# EAGLE design CombinedBackplane02_shorter_2layer (EAGLE 7.7.0)

## Sheet 1 of 4
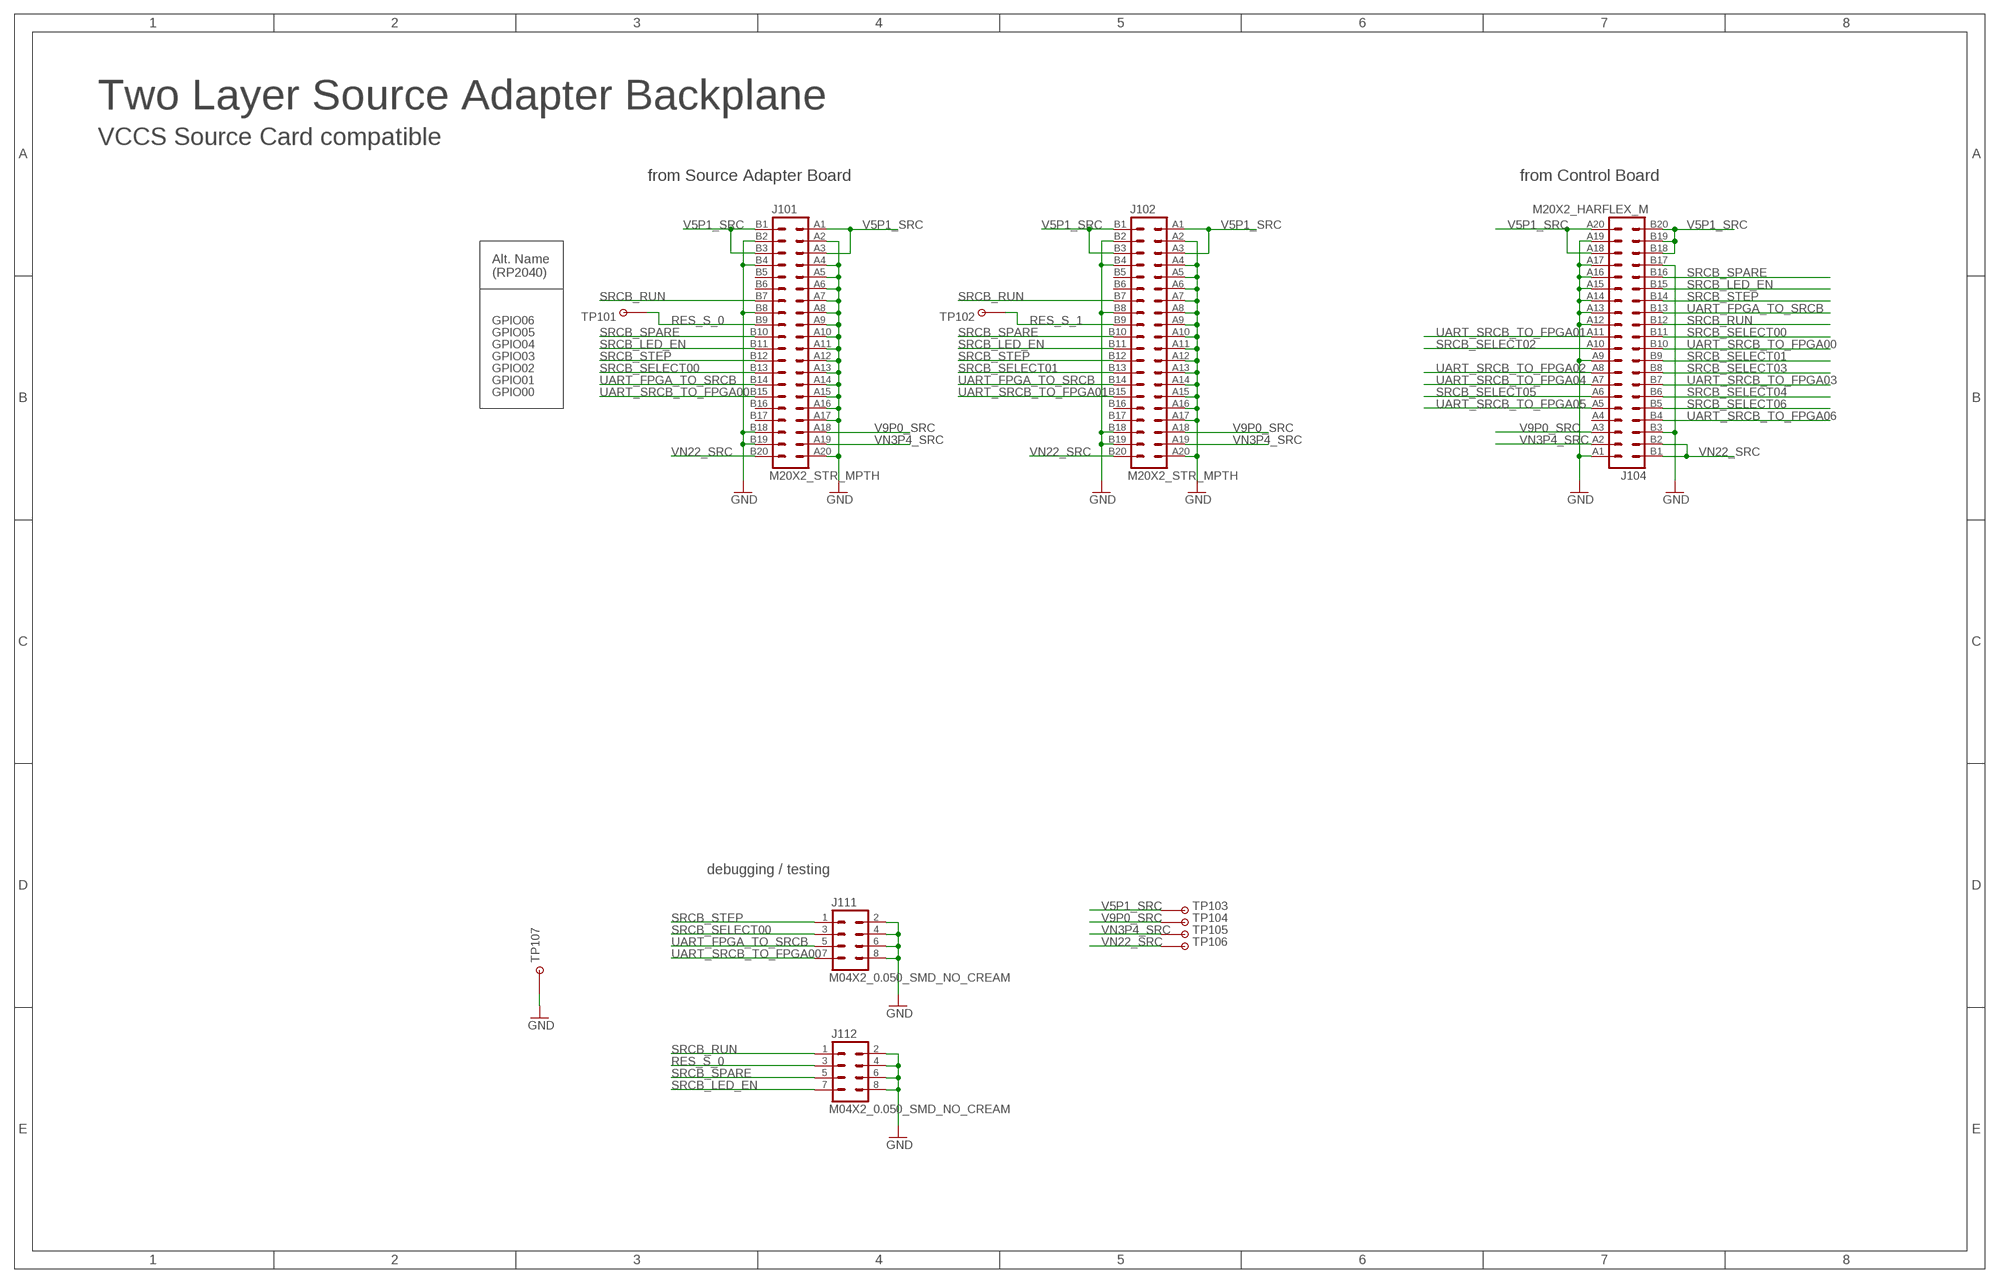
[diagram p0: schematic, sheet 1]

### Parts
J101  M20X2_STR_MPTH  [M20X2_HARFLEX_F_STR_MPTH]
J102  M20X2_STR_MPTH  [M20X2_HARFLEX_F_STR_MPTH]
J104  M20X2_HARFLEX_M  [M20X2_HARFLEX_M]
J111  M04X2_0.050_SMD_NO_CREAM  [M04X2_0.050_SMD_NO_CREAM]
J112  M04X2_0.050_SMD_NO_CREAM  [M04X2_0.050_SMD_NO_CREAM]
TP101  TESTPOINT_ROUND  [TESTPAD_ROUND]
TP102  TESTPOINT_ROUND  [TESTPAD_ROUND]
TP103  TESTPOINT_ROUND  [TESTPAD_ROUND]
TP104  TESTPOINT_ROUND  [TESTPAD_ROUND]
TP105  TESTPOINT_ROUND  [TESTPAD_ROUND]
TP106  TESTPOINT_ROUND  [TESTPAD_ROUND]
TP107  TESTPOINT1X01  [1X01]

### Nets
GND_SRC: J101.A2 J101.A4 J101.A5 J101.A6 J101.A7 J101.A8 J101.A9 J101.A10 J101.A11 J101.A12 J101.A13 J101.A14 J101.A15 J101.A16 J101.A17 J101.A20 J101.B2 J101.B4 J101.B8 J101.B18 J101.B19 J102.A2 J102.A4 J102.A5 J102.A6 J102.A7 J102.A8 J102.A9 J102.A10 J102.A11 J102.A12 J102.A13 J102.A14 J102.A15 J102.A16 J102.A17 J102.A20 J102.B2 J102.B4 J102.B8 J102.B18 J102.B19 J104.A1 J104.A9 J104.A12 J104.A13 J104.A14 J104.A15 J104.A16 J104.A17 J104.A19 J104.B3 J104.B17 J111.2 J111.4 J111.6 J111.8 J112.2 J112.4 J112.6 J112.8 TP107.1 ; supply symbol labelled GND
RES_S_0: J101.B9 J112.3 TP101.P$1
RES_S_1: J102.B9 TP102.P$1
SRCB_LED_EN: J101.B11 J102.B11 J104.B15 J112.7
SRCB_RUN: J101.B7 J102.B7 J104.B12 J112.1
SRCB_SELECT00: J101.B13 J104.B11 J111.3
SRCB_SELECT01: J102.B13 J104.B9
SRCB_SELECT02: J104.A10
SRCB_SELECT03: J104.B8
SRCB_SELECT04: J104.B6
SRCB_SELECT05: J104.A6
SRCB_SELECT06: J104.B5
SRCB_SPARE: J101.B10 J102.B10 J104.B16 J112.5
SRCB_STEP: J101.B12 J102.B12 J104.B14 J111.1
UART_FPGA_TO_SRCB: J101.B14 J102.B14 J104.B13 J111.5
UART_SRCB_TO_FPGA00: J101.B15 J104.B10 J111.7
UART_SRCB_TO_FPGA01: J102.B15 J104.A11
UART_SRCB_TO_FPGA02: J104.A8
UART_SRCB_TO_FPGA03: J104.B7
UART_SRCB_TO_FPGA04: J104.A7
UART_SRCB_TO_FPGA05: J104.A5
UART_SRCB_TO_FPGA06: J104.B4
V5P1_SRC: J101.A1 J101.A3 J101.B1 J101.B3 J102.A1 J102.A3 J102.B1 J102.B3 J104.A18 J104.A20 J104.B18 J104.B19 J104.B20 TP103.P$1
V9P0_SRC: J101.A18 J102.A18 J104.A3 TP104.P$1
VN3P4_SRC: J101.A19 J102.A19 J104.A2 TP105.P$1
VN22_SRC: J101.B20 J102.B20 J104.B1 J104.B2 TP106.P$1
Unconnected: J101.B5 J101.B6 J101.B16 J101.B17 J102.B5 J102.B6 J102.B16 J102.B17 J104.A4

### Notes on the sheet
- Two Layer Source Adapter Backplane
- VCCS Source Card compatible
- from Source Adapter Board | from Control Board
- Alt. Name
  (RP2040)
- GPIO06
- GPIO05
- GPIO04
- GPIO03
- GPIO02
- GPIO01
- GPIO00
- debugging / testing

## Sheet 2 of 4
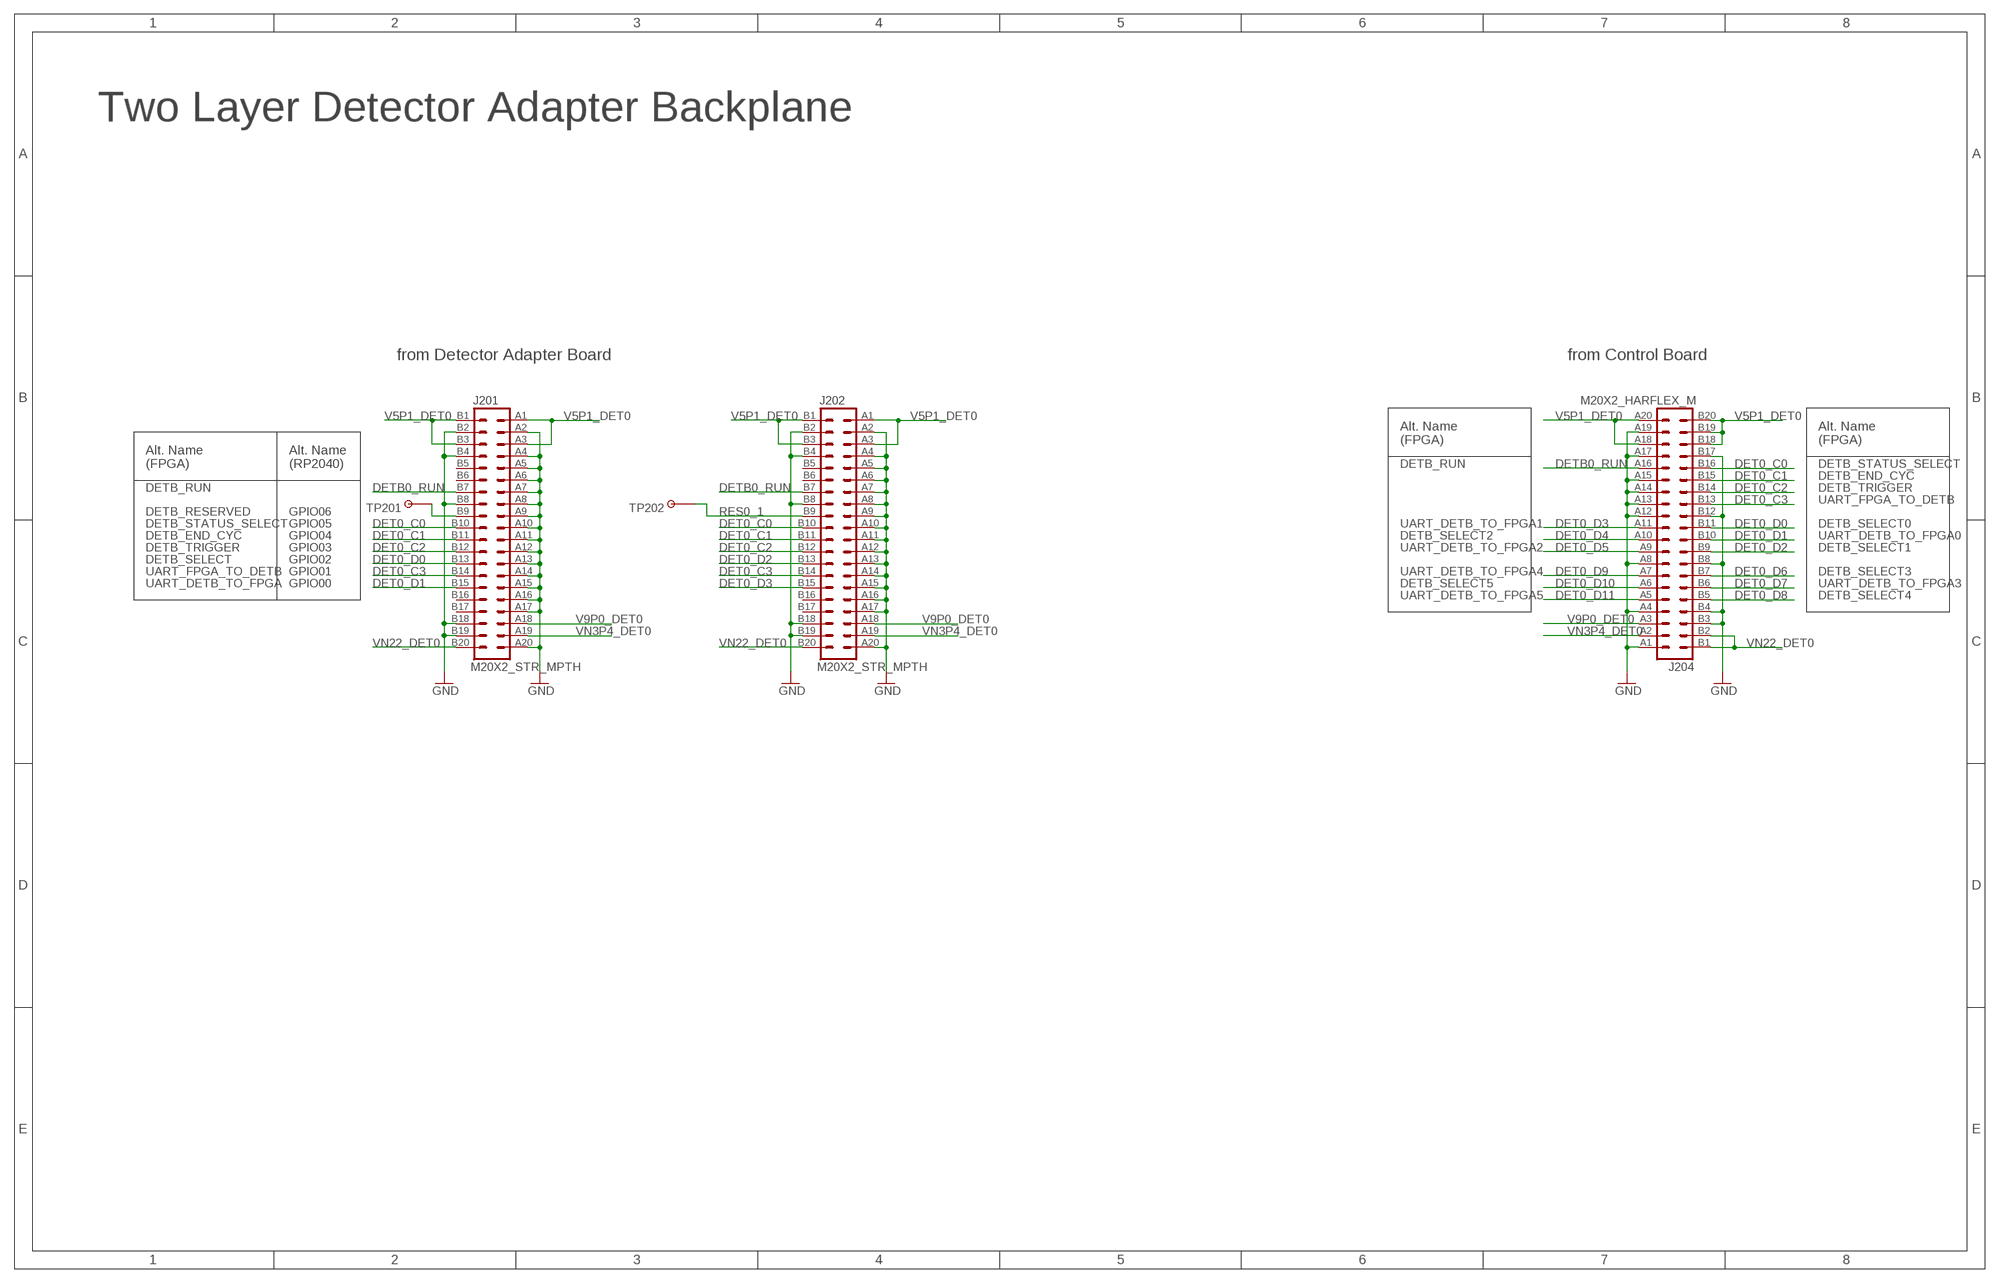
[diagram p1: schematic, sheet 2]

### Parts
J201  M20X2_STR_MPTH  [M20X2_HARFLEX_F_STR_MPTH]
J202  M20X2_STR_MPTH  [M20X2_HARFLEX_F_STR_MPTH]
J204  M20X2_HARFLEX_M  [M20X2_HARFLEX_M]
TP201  TESTPOINT_ROUND  [TESTPAD_ROUND]
TP202  TESTPOINT_ROUND  [TESTPAD_ROUND]

### Nets
DET0_C0: J201.B10 J202.B10 J204.B16
DET0_C1: J201.B11 J202.B11 J204.B15
DET0_C2: J201.B12 J202.B12 J204.B14
DET0_C3: J201.B14 J202.B14 J204.B13
DET0_D0: J201.B13 J204.B11
DET0_D1: J201.B15 J204.B10
DET0_D2: J202.B13 J204.B9
DET0_D3: J202.B15 J204.A11
DET0_D4: J204.A10
DET0_D5: J204.A9
DET0_D6: J204.B7
DET0_D7: J204.B6
DET0_D8: J204.B5
DET0_D9: J204.A7
DET0_D10: J204.A6
DET0_D11: J204.A5
DETB0_RUN: J201.B7 J202.B7 J204.A16
GND: J201.A2 J201.A4 J201.A5 J201.A6 J201.A7 J201.A8 J201.A9 J201.A10 J201.A11 J201.A12 J201.A13 J201.A14 J201.A15 J201.A16 J201.A17 J201.A20 J201.B2 J201.B4 J201.B8 J201.B18 J201.B19 J202.A2 J202.A4 J202.A5 J202.A6 J202.A7 J202.A8 J202.A9 J202.A10 J202.A11 J202.A12 J202.A13 J202.A14 J202.A15 J202.A16 J202.A17 J202.A20 J202.B2 J202.B4 J202.B8 J202.B18 J202.B19 J204.A1 J204.A4 J204.A8 J204.A12 J204.A13 J204.A14 J204.A15 J204.A17 J204.A19 J204.B3 J204.B4 J204.B8 J204.B12 J204.B17 ; also sheet 3,4
N$2: J201.B9 TP201.P$1
RES0_1: J202.B9 TP202.P$1
V5P1_DET0: J201.A1 J201.A3 J201.B1 J201.B3 J202.A1 J202.A3 J202.B1 J202.B3 J204.A18 J204.A20 J204.B18 J204.B19 J204.B20
V9P0_DET0: J201.A18 J202.A18 J204.A3
VN3P4_DET0: J201.A19 J202.A19 J204.A2
VN22_DET0: J201.B20 J202.B20 J204.B1 J204.B2
Unconnected: J201.B5 J201.B6 J201.B16 J201.B17 J202.B5 J202.B6 J202.B16 J202.B17

### Notes on the sheet
- Two Layer Detector Adapter Backplane
- from Detector Adapter Board | from Control Board
- Alt. Name
  (FPGA)
- Alt. Name
  (FPGA)
- Alt. Name
  (FPGA)
- Alt. Name
  (RP2040)
- DETB_RUN | DETB_STATUS_SELECT
- DETB_END_CYC
- DETB_RUN | DETB_TRIGGER
- UART_FPGA_TO_DETB
- DETB_RESERVED | GPIO06
- DETB_STATUS_SELECT | GPIO05 | UART_DETB_TO_FPGA1 | DETB_SELECT0
- DETB_END_CYC | GPIO04 | DETB_SELECT2 | UART_DETB_TO_FPGA0
- DETB_TRIGGER | GPIO03 | UART_DETB_TO_FPGA2 | DETB_SELECT1
- DETB_SELECT | GPIO02
- UART_FPGA_TO_DETB | GPIO01 | UART_DETB_TO_FPGA4 | DETB_SELECT3
- UART_DETB_TO_FPGA | GPIO00 | DETB_SELECT5 | UART_DETB_TO_FPGA3
- UART_DETB_TO_FPGA5 | DETB_SELECT4

## Sheet 3 of 4
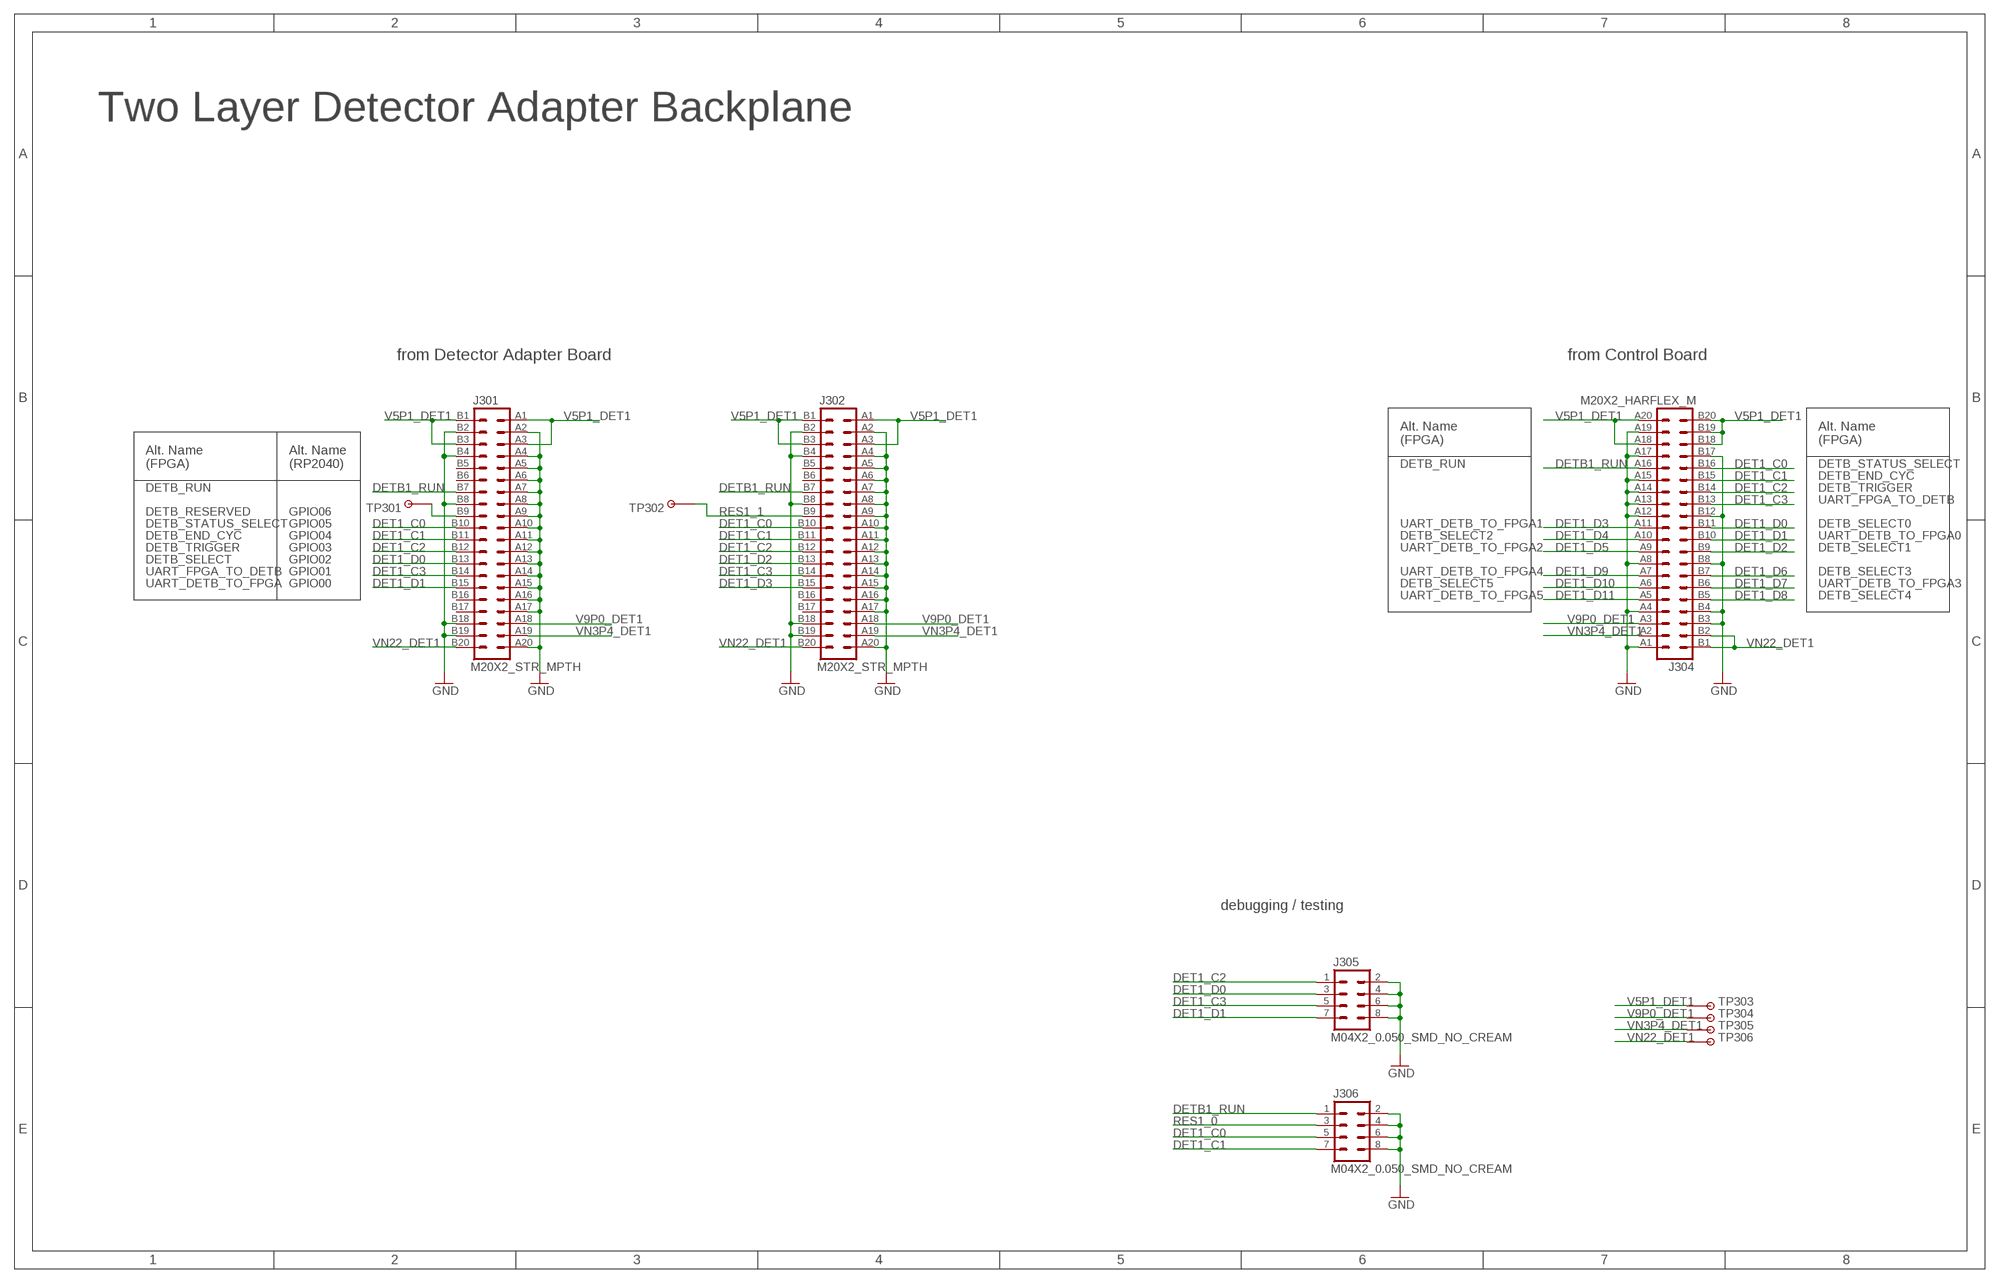
[diagram p2: schematic, sheet 3]

### Parts
J301  M20X2_STR_MPTH  [M20X2_HARFLEX_F_STR_MPTH]
J302  M20X2_STR_MPTH  [M20X2_HARFLEX_F_STR_MPTH]
J304  M20X2_HARFLEX_M  [M20X2_HARFLEX_M]
J305  M04X2_0.050_SMD_NO_CREAM  [M04X2_0.050_SMD_NO_CREAM]
J306  M04X2_0.050_SMD_NO_CREAM  [M04X2_0.050_SMD_NO_CREAM]
TP301  TESTPOINT_ROUND  [TESTPAD_ROUND]
TP302  TESTPOINT_ROUND  [TESTPAD_ROUND]
TP303  TESTPOINT_ROUND  [TESTPAD_ROUND]
TP304  TESTPOINT_ROUND  [TESTPAD_ROUND]
TP305  TESTPOINT_ROUND  [TESTPAD_ROUND]
TP306  TESTPOINT_ROUND  [TESTPAD_ROUND]

### Nets
DET1_C0: J301.B10 J302.B10 J304.B16 J306.5
DET1_C1: J301.B11 J302.B11 J304.B15 J306.7
DET1_C2: J301.B12 J302.B12 J304.B14 J305.1
DET1_C3: J301.B14 J302.B14 J304.B13 J305.5
DET1_D0: J301.B13 J304.B11 J305.3
DET1_D1: J301.B15 J304.B10 J305.7
DET1_D2: J302.B13 J304.B9
DET1_D3: J302.B15 J304.A11
DET1_D4: J304.A10
DET1_D5: J304.A9
DET1_D6: J304.B7
DET1_D7: J304.B6
DET1_D8: J304.B5
DET1_D9: J304.A7
DET1_D10: J304.A6
DET1_D11: J304.A5
DETB1_RUN: J301.B7 J302.B7 J304.A16 J306.1
GND: J301.A2 J301.A4 J301.A5 J301.A6 J301.A7 J301.A8 J301.A9 J301.A10 J301.A11 J301.A12 J301.A13 J301.A14 J301.A15 J301.A16 J301.A17 J301.A20 J301.B2 J301.B4 J301.B8 J301.B18 J301.B19 J302.A2 J302.A4 J302.A5 J302.A6 J302.A7 J302.A8 J302.A9 J302.A10 J302.A11 J302.A12 J302.A13 J302.A14 J302.A15 J302.A16 J302.A17 J302.A20 J302.B2 J302.B4 J302.B8 J302.B18 J302.B19 J304.A1 J304.A4 J304.A8 J304.A12 J304.A13 J304.A14 J304.A15 J304.A17 J304.A19 J304.B3 J304.B4 J304.B8 J304.B12 J304.B17 J305.2 J305.4 J305.6 J305.8 J306.2 J306.4 J306.6 J306.8 ; also sheet 2,4
RES1_0: J301.B9 J306.3 TP301.P$1
RES1_1: J302.B9 TP302.P$1
V5P1_DET1: J301.A1 J301.A3 J301.B1 J301.B3 J302.A1 J302.A3 J302.B1 J302.B3 J304.A18 J304.A20 J304.B18 J304.B19 J304.B20 TP303.P$1
V9P0_DET1: J301.A18 J302.A18 J304.A3 TP304.P$1
VN3P4_DET1: J301.A19 J302.A19 J304.A2 TP305.P$1
VN22_DET1: J301.B20 J302.B20 J304.B1 J304.B2 TP306.P$1
Unconnected: J301.B5 J301.B6 J301.B16 J301.B17 J302.B5 J302.B6 J302.B16 J302.B17

### Notes on the sheet
- Two Layer Detector Adapter Backplane
- from Detector Adapter Board | from Control Board
- Alt. Name
  (FPGA)
- Alt. Name
  (FPGA)
- Alt. Name
  (FPGA)
- Alt. Name
  (RP2040)
- DETB_RUN | DETB_STATUS_SELECT
- DETB_END_CYC
- DETB_RUN | DETB_TRIGGER
- UART_FPGA_TO_DETB
- DETB_RESERVED | GPIO06
- DETB_STATUS_SELECT | GPIO05 | UART_DETB_TO_FPGA1 | DETB_SELECT0
- DETB_END_CYC | GPIO04 | DETB_SELECT2 | UART_DETB_TO_FPGA0
- DETB_TRIGGER | GPIO03 | UART_DETB_TO_FPGA2 | DETB_SELECT1
- DETB_SELECT | GPIO02
- UART_FPGA_TO_DETB | GPIO01 | UART_DETB_TO_FPGA4 | DETB_SELECT3
- UART_DETB_TO_FPGA | GPIO00 | DETB_SELECT5 | UART_DETB_TO_FPGA3
- UART_DETB_TO_FPGA5 | DETB_SELECT4
- debugging / testing

## Sheet 4 of 4
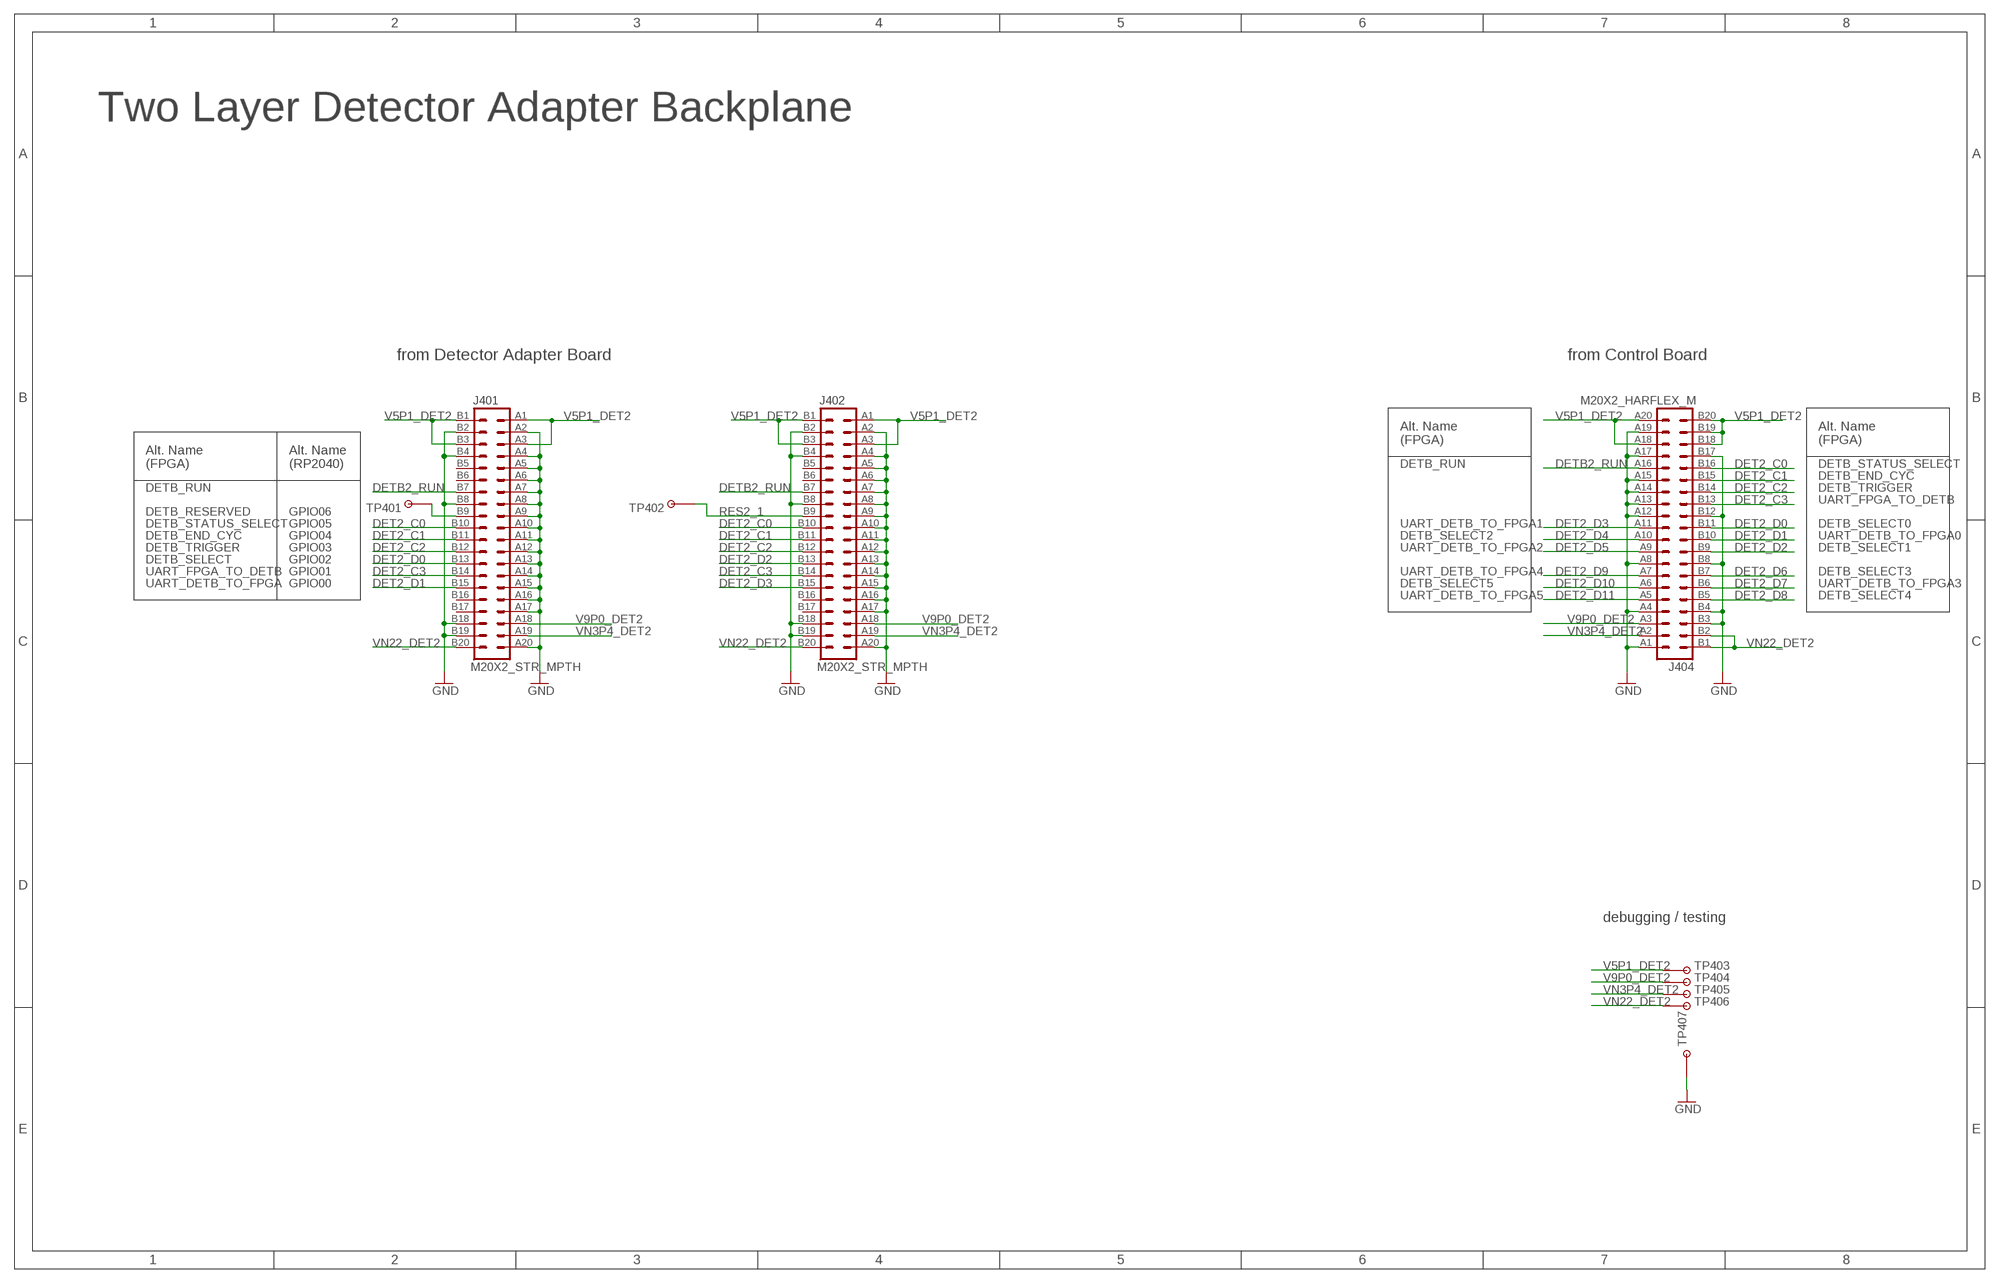
[diagram p3: schematic, sheet 4]

### Parts
J401  M20X2_STR_MPTH  [M20X2_HARFLEX_F_STR_MPTH]
J402  M20X2_STR_MPTH  [M20X2_HARFLEX_F_STR_MPTH]
J404  M20X2_HARFLEX_M  [M20X2_HARFLEX_M]
TP401  TESTPOINT_ROUND  [TESTPAD_ROUND]
TP402  TESTPOINT_ROUND  [TESTPAD_ROUND]
TP403  TESTPOINT_ROUND  [TESTPAD_ROUND]
TP404  TESTPOINT_ROUND  [TESTPAD_ROUND]
TP405  TESTPOINT_ROUND  [TESTPAD_ROUND]
TP406  TESTPOINT_ROUND  [TESTPAD_ROUND]
TP407  TESTPOINT1X01  [1X01]

### Nets
DET2_C0: J401.B10 J402.B10 J404.B16
DET2_C1: J401.B11 J402.B11 J404.B15
DET2_C2: J401.B12 J402.B12 J404.B14
DET2_C3: J401.B14 J402.B14 J404.B13
DET2_D0: J401.B13 J404.B11
DET2_D1: J401.B15 J404.B10
DET2_D2: J402.B13 J404.B9
DET2_D3: J402.B15 J404.A11
DET2_D4: J404.A10
DET2_D5: J404.A9
DET2_D6: J404.B7
DET2_D7: J404.B6
DET2_D8: J404.B5
DET2_D9: J404.A7
DET2_D10: J404.A6
DET2_D11: J404.A5
DETB2_RUN: J401.B7 J402.B7 J404.A16
GND: J401.A2 J401.A4 J401.A5 J401.A6 J401.A7 J401.A8 J401.A9 J401.A10 J401.A11 J401.A12 J401.A13 J401.A14 J401.A15 J401.A16 J401.A17 J401.A20 J401.B2 J401.B4 J401.B8 J401.B18 J401.B19 J402.A2 J402.A4 J402.A5 J402.A6 J402.A7 J402.A8 J402.A9 J402.A10 J402.A11 J402.A12 J402.A13 J402.A14 J402.A15 J402.A16 J402.A17 J402.A20 J402.B2 J402.B4 J402.B8 J402.B18 J402.B19 J404.A1 J404.A4 J404.A8 J404.A12 J404.A13 J404.A14 J404.A15 J404.A17 J404.A19 J404.B3 J404.B4 J404.B8 J404.B12 J404.B17 TP407.1 ; also sheet 2,3
RES2_0: J401.B9 TP401.P$1
RES2_1: J402.B9 TP402.P$1
V5P1_DET2: J401.A1 J401.A3 J401.B1 J401.B3 J402.A1 J402.A3 J402.B1 J402.B3 J404.A18 J404.A20 J404.B18 J404.B19 J404.B20 TP403.P$1
V9P0_DET2: J401.A18 J402.A18 J404.A3 TP404.P$1
VN3P4_DET2: J401.A19 J402.A19 J404.A2 TP405.P$1
VN22_DET2: J401.B20 J402.B20 J404.B1 J404.B2 TP406.P$1
Unconnected: J401.B5 J401.B6 J401.B16 J401.B17 J402.B5 J402.B6 J402.B16 J402.B17

### Notes on the sheet
- Two Layer Detector Adapter Backplane
- from Detector Adapter Board | from Control Board
- Alt. Name
  (FPGA)
- Alt. Name
  (FPGA)
- Alt. Name
  (FPGA)
- Alt. Name
  (RP2040)
- DETB_RUN | DETB_STATUS_SELECT
- DETB_END_CYC
- DETB_RUN | DETB_TRIGGER
- UART_FPGA_TO_DETB
- DETB_RESERVED | GPIO06
- DETB_STATUS_SELECT | GPIO05 | UART_DETB_TO_FPGA1 | DETB_SELECT0
- DETB_END_CYC | GPIO04 | DETB_SELECT2 | UART_DETB_TO_FPGA0
- DETB_TRIGGER | GPIO03 | UART_DETB_TO_FPGA2 | DETB_SELECT1
- DETB_SELECT | GPIO02
- UART_FPGA_TO_DETB | GPIO01 | UART_DETB_TO_FPGA4 | DETB_SELECT3
- UART_DETB_TO_FPGA | GPIO00 | DETB_SELECT5 | UART_DETB_TO_FPGA3
- UART_DETB_TO_FPGA5 | DETB_SELECT4
- debugging / testing

## Library data of the parts
J101 J102 J104 J201 J202 J204 J301 J302 J304 J401 J402 J404 = MyLib:M20X2
J111 J112 J305 J306 = MyLib:M04X2
TP101-TP107 TP201 TP202 TP301-TP306 TP401-TP407 = MyLib:TESTPOINT

## Board
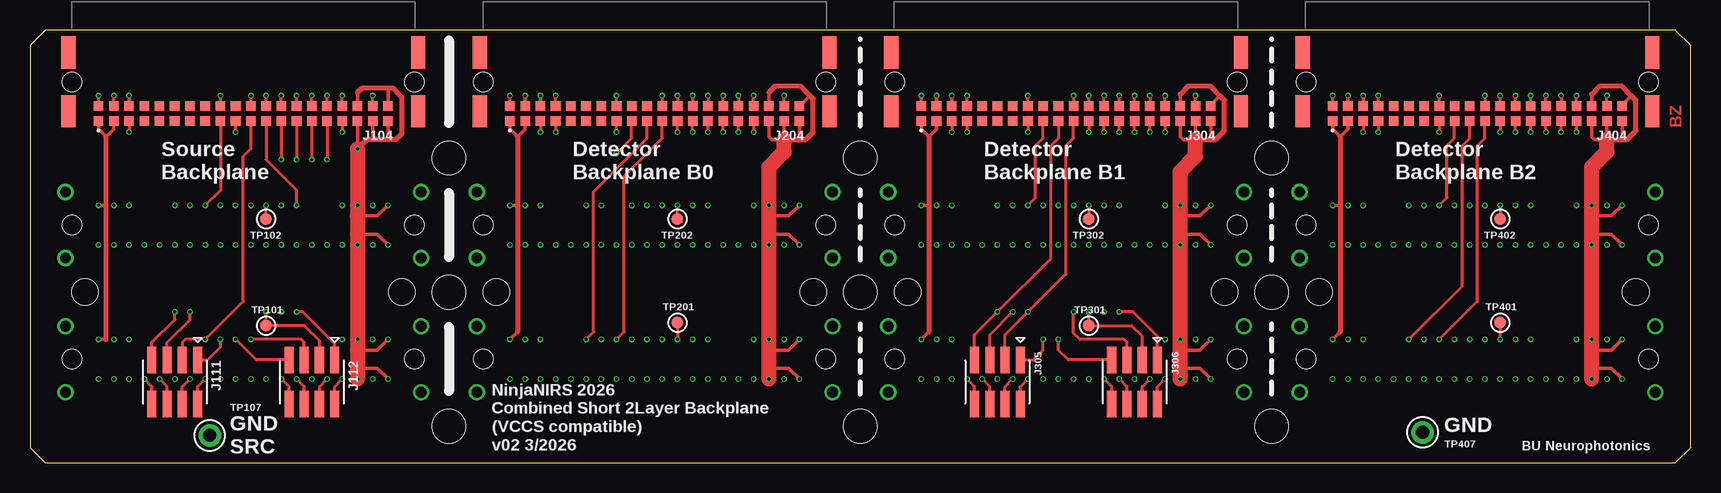
[diagram p4: board, top side]
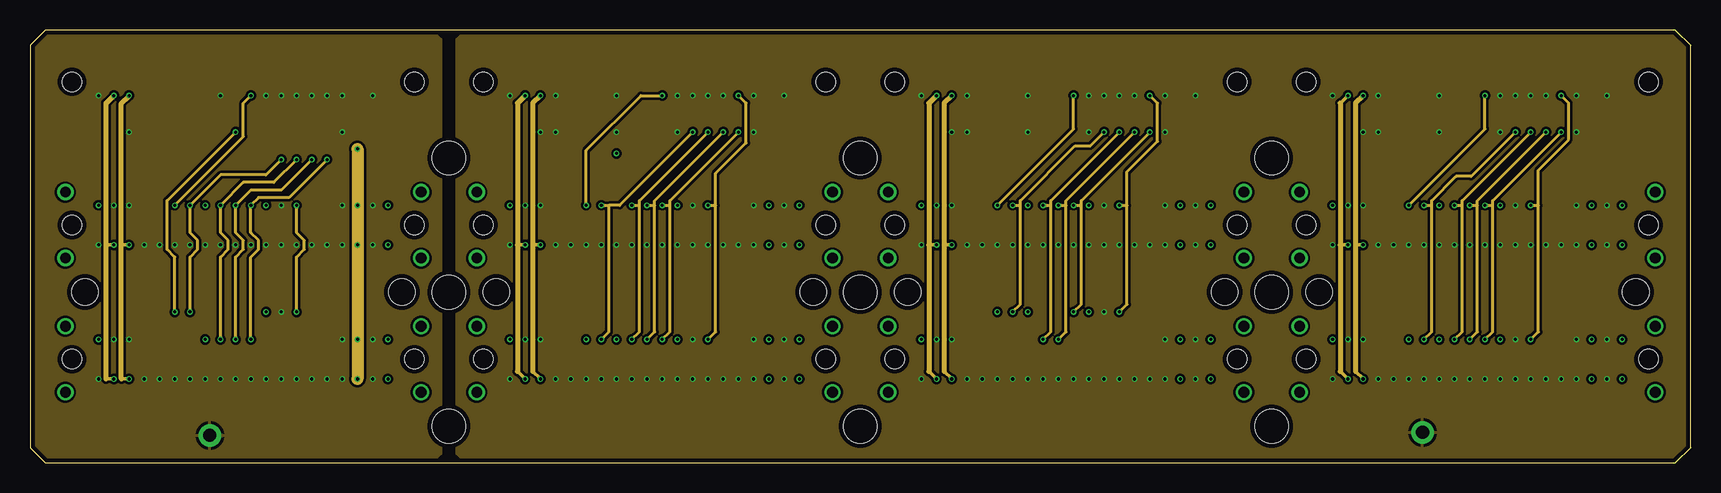
[diagram p5: board, inner layer Route2]
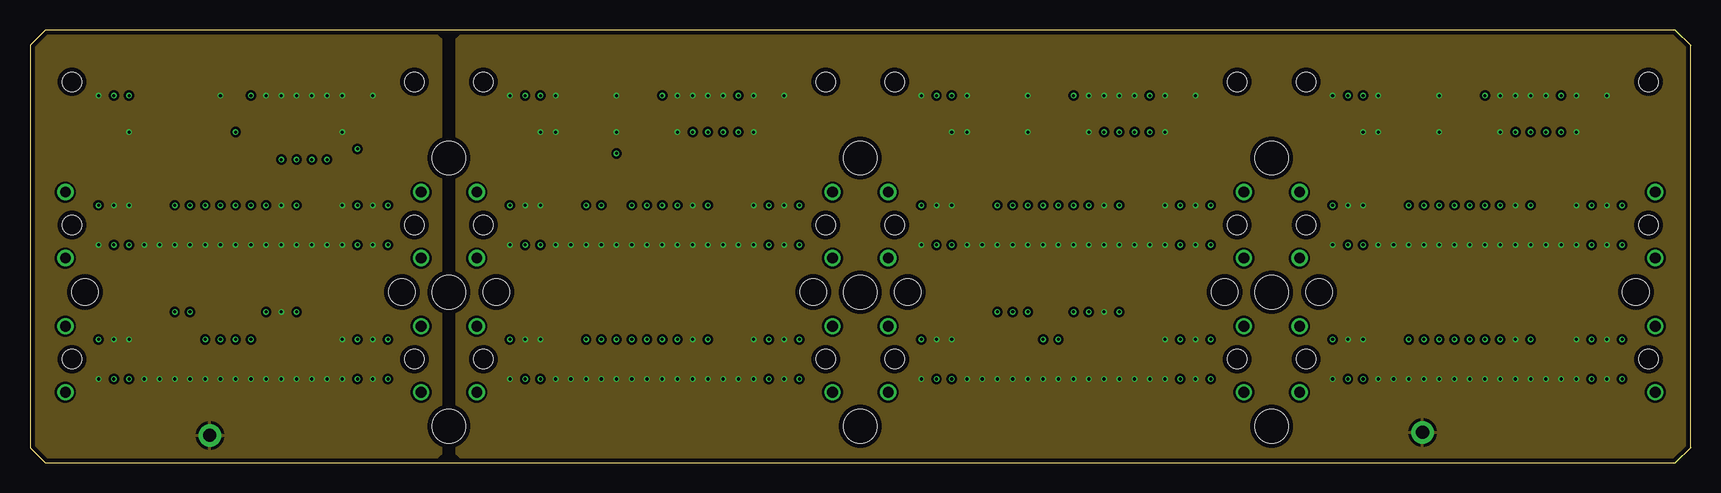
[diagram p6: board, inner layer Route15]
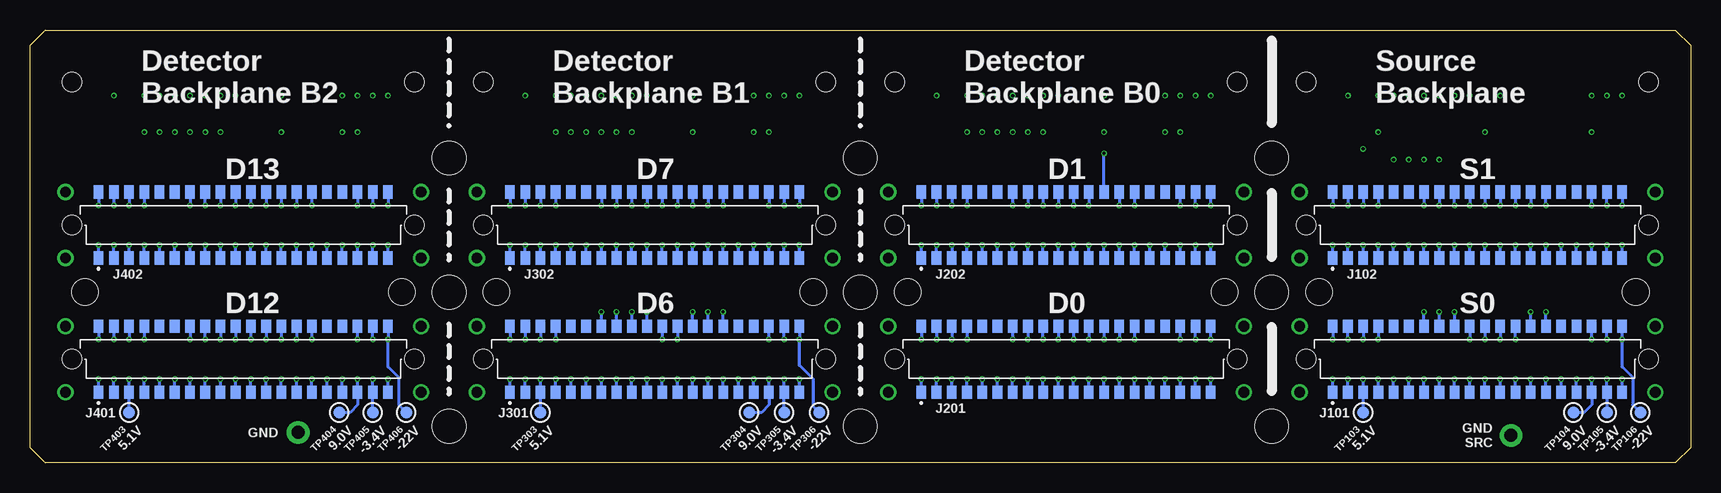
[diagram p7: board, bottom side, seen from below]

Size 138.43 x 36.07 mm. Coordinates in mm from the lower left corner, seen from the top.
Outline: 1.27,0 137.16,0 138.43,1.27 138.43,34.8 137.16,36.07 1.27,36.07 0,34.8 0,1.27 1.27,0
Copper layers (1*2*15*16): Top 0.035559375mm / dielectric 0.17018125mm / Route2 0.01778125mm / dielectric 47mil / Route15 0.01778125mm / dielectric 0.17018125mm / Bottom 0.035559375mm
Design rules "OSHPark-4layer *": minimum track width 5mil, minimum drill 10mil, track to track 5mil, track to pad 5mil, pad to pad 5mil, via to via 5mil, smd to smd 5mil, copper to edge 15mil, drill to drill 6mil, minimum pad ring 4mil, minimum via ring 4mil, stop-mask expansion 2.5mil, vias tented up to drill 12mil, thermal gap 10mil
Holes 2.2 mm at 4.57,14.22 38.86,14.22 73.15,14.22 107.44,14.22 65.28,14.22 99.57,14.22 133.86,14.22 30.99,14.22
Holes 2.8 mm at 34.92,14.22 69.22,14.22 103.5,14.22 34.92,25.4 69.22,25.4 103.5,25.4 34.92,3.05 69.22,3.05 103.5,3.05
tKeepout: area 32.4,11.7 to 37.5,16.8; area 32.4,22.9 to 37.5,27.9; area 66.7,22.9 to 71.8,27.9; area 101,22.9 to 106,27.9; area 32.4,0.5 to 37.5,5.6; area 66.7,11.7 to 71.8,16.8; area 66.7,0.5 to 71.8,5.6; area 101,11.7 to 106,16.8; area 101,0.5 to 106,5.6
tRestrict: 16 lines

### Footprints (pad centres in the part's own frame; a part is rotated, then mirrored left to right if it is on the bottom)
M20X2_HARFLEX_F_STR_MPTH = smd 0.8 x 1.1: A1 12.065,2.75; A2 10.795,2.75; A3 9.525,2.75; A4 8.255,2.75; A5 6.985,2.75; A6 5.715,2.75; A7 4.445,2.75; A8 3.175,2.75; A9 1.905,2.75; A10 0.635,2.75; A11 -0.635,2.75; A12 -1.905,2.75; A13 -3.175,2.75; A14 -4.445,2.75; A15 -5.715,2.75; A16 -6.985,2.75; A17 -8.255,2.75; A18 -9.525,2.75; A19 -10.795,2.75; A20 -12.065,2.75; B1 12.065,-2.75; B2 10.795,-2.75; B3 9.525,-2.75; B4 8.255,-2.75; B5 6.985,-2.75; B6 5.715,-2.75; B7 4.445,-2.75; B8 3.175,-2.75; B9 1.905,-2.75; B10 0.635,-2.75; B11 -0.635,-2.75; B12 -1.905,-2.75; B13 -3.175,-2.75; B14 -4.445,-2.75; B15 -5.715,-2.75; B16 -6.985,-2.75; B17 -8.255,-2.75; B18 -9.525,-2.75; B19 -10.795,-2.75; B20 -12.065,-2.75 | drill 0.9 pad 1.35: M1 -14.825,2.75; M2 14.825,2.75; M3 -14.825,-2.75; M4 14.825,-2.75 | hole 1.6: -14.275,0; 14.275,0
M20X2_HARFLEX_M = smd 0.8 x 0.8: A1 12.065,2; A2 10.795,2; A3 9.525,2; A4 8.255,2; A5 6.985,2; A6 5.715,2; A7 4.445,2; A8 3.175,2; A9 1.905,2; A10 0.635,2; A11 -0.635,2; A12 -1.905,2; A13 -3.175,2; A14 -4.445,2; A15 -5.715,2; A16 -6.985,2; A17 -8.255,2; A18 -9.525,2; A19 -10.795,2; A20 -12.065,2; B1 12.065,3.27; B2 10.795,3.27; B3 9.525,3.27; B4 8.255,3.27; B5 6.985,3.27; B6 5.715,3.27; B7 4.445,3.27; B8 3.175,3.27; B9 1.905,3.27; B10 0.635,3.27; B11 -0.635,3.27; B12 -1.905,3.27; B13 -3.175,3.27; B14 -4.445,3.27; B15 -5.715,3.27; B16 -6.985,3.27; B17 -8.255,3.27; B18 -9.525,3.27; B19 -10.795,3.27; B20 -12.065,3.27 | smd 1.2 x 2.7: P$17 -14.575,2.45; P$18 -14.575,-2.45; P$19 14.575,2.45; P$20 14.575,-2.45 | hole 1.6: -14.275,0; 14.275,0
M04X2_0.050_SMD_NO_CREAM = smd 2.21 x 0.762: 1 -1.841,1.905; 2 1.841,1.905; 3 -1.841,0.635; 4 1.841,0.635; 5 -1.841,-0.635; 6 1.841,-0.635; 7 -1.841,-1.905; 8 1.841,-1.905
TESTPAD_ROUND = smd 1.016 x 1.016: P$1 0,0
1X01 = drill 1.1 pad 1.88: 1 0,0

### Placement (x,y rotation side)
J101  17.78,8.64 180 bottom
J102  17.78,19.81 180 bottom
J104  17.78,31.75 180 top
J111  12.06,6.73 270 top
J112  23.5,6.73 270 top
J201  52.07,8.64 180 bottom
J202  52.07,19.81 180 bottom
J204  52.07,31.75 180 top
J301  86.36,8.64 180 bottom
J302  86.36,19.81 180 bottom
J304  86.36,31.75 180 top
J305  80.64,6.73 270 top
J306  92.08,6.73 270 top
J401  120.65,8.64 180 bottom
J402  120.65,19.81 180 bottom
J404  120.65,31.75 180 top
TP101  19.68,11.43 0 top
TP102  19.68,20.32 0 top
TP103  27.3,4.19 0 bottom
TP104  9.78,4.19 0 bottom
TP105  6.99,4.19 0 bottom
TP106  4.19,4.19 0 bottom
TP107  14.99,2.29 0 top
TP201  53.98,11.68 0 top
TP202  53.98,20.32 0 top
TP301  88.27,11.43 0 top
TP302  88.27,20.32 0 top
TP303  95.89,4.19 180 bottom
TP304  78.49,4.19 180 bottom
TP305  75.56,4.19 180 bottom
TP306  72.64,4.19 180 bottom
TP401  122.56,11.68 0 top
TP402  122.56,20.32 0 top
TP403  130.18,4.19 180 bottom
TP404  112.65,4.19 180 bottom
TP405  109.86,4.19 180 bottom
TP406  107.06,4.19 180 bottom
TP407  116.08,2.54 0 top

### Tracks (layer width: path | path; a pad name or v marks a point on that pad's centre or on a via)
DET0_C0  (via drill 0.25)
  Top 0.254: v59.05,27.56 J204.B16
  Route2 0.254: v52.7,10.29 53.34,10.92 53.34,21.46 | 53.34,21.46 53.34,21.84 v59.05,27.56 | v52.7,21.46 53.34,21.46
  Bottom 0.254: J202.B10 v52.7,21.46 | J201.B10 v52.7,10.29
DET0_C1  (via drill 0.25)
  Top 0.254: v57.78,27.56 J204.B15
  Route2 0.254: v51.44,10.29 52.07,10.92 52.07,21.46 | 52.07,21.46 52.07,21.84 v57.78,27.56 | v51.44,21.46 52.07,21.46
  Bottom 0.254: J202.B11 v51.44,21.46 | J201.B11 v51.44,10.29
DET0_C2  (via drill 0.25)
  Top 0.254: v56.52,27.56 J204.B14
  Route2 0.254: v50.16,10.29 50.8,10.92 50.8,21.46 | 50.8,21.46 50.8,21.84 v56.52,27.56 | v50.16,21.46 50.8,21.46
  Bottom 0.254: J202.B12 v50.16,21.46 | J201.B12 v50.16,10.29
DET0_C3  (via drill 0.25)
  Top 0.254: v55.24,27.56 J204.B13
  Route2 0.254: v47.62,10.29 48.26,10.92 48.26,21.46 | v47.62,21.46 48.26,21.46 | v55.24,27.56 49.15,21.46 48.26,21.46
  Bottom 0.254: J202.B14 v47.62,21.46 | J201.B14 v47.62,10.29
DET0_D0  (via drill 0.25)
  Top 0.254: v48.9,10.29 49.53,10.92 49.53,23.88 52.7,27.05 J204.B11
  Bottom 0.254: J201.B13 v48.9,10.29
DET0_D1  (via drill 0.25)
  Top 0.254: v46.35,10.29 46.99,10.92 46.99,22.61 51.44,27.05 J204.B10
  Bottom 0.254: J201.B15 v46.35,10.29
DET0_D2  (via drill 0.25)
  Top 0.254: J204.B9 50.16,27.05 v48.9,25.78
  Bottom 0.254: J202.B13 v48.9,25.78
DET0_D3  (via drill 0.25)
  Top 0.254: v52.7,30.61 J204.A11
  Route2 0.254: v46.35,21.46 46.35,26.04 50.93,30.61 v52.7,30.61
  Bottom 0.254: J202.B15 v46.35,21.46
DET1_C0  (via drill 0.25)
  Top 0.254: v93.34,27.56 J304.B16 | J306.5 91.44,10.03 91.19,10.29 87.5,10.29 87,10.79 v87,12.57
  Route2 0.254: v87,12.57 87.63,13.21 87.63,21.46 | 87.63,21.46 87.63,21.84 v93.34,27.56 | v87,21.46 87.63,21.46
  Bottom 0.254: J302.B10 v87,21.46 | J301.B10 v87,12.57
DET1_C1  (via drill 0.25)
  Top 0.254: v92.08,27.56 J304.B15 | J306.7 86.55,8.57 85.72,9.4 v85.72,10.29
  Route2 0.254: v85.72,10.29 86.36,10.92 86.36,21.46 | 86.36,21.46 86.36,21.84 v92.08,27.56 | v85.72,21.46 86.36,21.46
  Bottom 0.254: J302.B11 v85.72,21.46 | J301.B11 v85.72,10.29
DET1_C2  (via drill 0.25)
  Top 0.254: v90.81,27.56 J304.B14 | J305.1 83.63,8.57 84.45,9.4 v84.45,10.29
  Route2 0.254: v84.45,10.29 85.09,10.92 85.09,21.46 | 85.09,21.46 85.09,21.84 v90.81,27.56 | v84.45,21.46 85.09,21.46
  Bottom 0.254: J302.B12 v84.45,21.46 | J301.B12 v84.45,10.29
DET1_C3  (via drill 0.25)
  Top 0.254: v89.53,27.56 J304.B13 | J305.5 80.01,10.67 v81.92,12.57
  Route2 0.254: v81.92,12.57 82.55,13.21 82.55,21.46 | 82.55,21.46 82.55,21.84 87.12,26.42 88.39,26.42 v89.53,27.56 | v81.92,21.46 82.55,21.46
  Bottom 0.254: J302.B14 v81.92,21.46 | J301.B14 v81.92,12.57
DET1_D0  (via drill 0.25)
  Top 0.254: J304.B11 87,27.05 86.36,26.42 86.36,15.75 v83.19,12.57 81.28,10.67 J305.3
  Bottom 0.254: J301.B13 v83.19,12.57
DET1_D1  (via drill 0.25)
  Top 0.254: J304.B10 85.72,27.05 85.09,26.42 85.09,17.02 v80.64,12.57 78.74,10.67 J305.7
  Bottom 0.254: J301.B15 v80.64,12.57
DET1_D2  (via drill 0.25)
  Top 0.254: v83.19,21.46 83.82,22.1 83.82,26.42 84.45,27.05 J304.B9
  Bottom 0.254: J302.B13 v83.19,21.46
DET1_D3  (via drill 0.25)
  Top 0.254: v87,30.61 J304.A11
  Route2 0.254: v87,30.61 87,27.81 v80.64,21.46
  Bottom 0.254: J302.B15 v80.64,21.46
DET2_C0  (via drill 0.25)
  Top 0.254: v127.64,27.56 J404.B16
  Route2 0.254: v121.28,10.29 121.92,10.92 121.92,21.46 | 121.92,21.46 121.92,21.84 v127.64,27.56 | v121.28,21.46 121.92,21.46
  Bottom 0.254: J401.B10 v121.28,10.29 | J402.B10 v121.28,21.46
DET2_C1  (via drill 0.25)
  Top 0.254: v126.36,27.56 J404.B15
  Route2 0.254: v120.02,10.29 120.65,10.92 120.65,21.46 | 120.65,21.46 120.65,21.84 v126.36,27.56 | v120.02,21.46 120.65,21.46
  Bottom 0.254: J401.B11 v120.02,10.29 | J402.B11 v120.02,21.46
DET2_C2  (via drill 0.25)
  Top 0.254: v125.09,27.56 J404.B14
  Route2 0.254: v118.75,10.29 119.38,10.92 119.38,21.46 | 119.38,21.46 119.38,21.84 v125.09,27.56 | v118.75,21.46 119.38,21.46
  Bottom 0.254: J401.B12 v118.75,10.29 | J402.B12 v118.75,21.46
DET2_C3  (via drill 0.25)
  Top 0.254: v123.83,27.56 J404.B13
  Route2 0.254: v116.2,10.29 116.84,10.92 116.84,21.46 | v116.2,21.46 116.84,21.46 | 116.84,21.46 116.84,21.84 118.87,23.88 120.14,23.88 v123.83,27.56
  Bottom 0.254: J401.B14 v116.2,10.29 | J402.B14 v116.2,21.46
DET2_D0  (via drill 0.25)
  Top 0.254: v117.47,10.29 120.65,13.46 120.65,26.42 121.28,27.05 J404.B11
  Bottom 0.254: J401.B13 v117.47,10.29
DET2_D1  (via drill 0.25)
  Top 0.254: v114.94,10.29 119.38,14.73 119.38,26.42 120.02,27.05 J404.B10
  Bottom 0.254: J401.B15 v114.94,10.29
DET2_D2  (via drill 0.25)
  Top 0.254: v117.47,21.46 118.11,22.1 118.11,26.42 118.75,27.05 J404.B9
  Bottom 0.254: J402.B13 v117.47,21.46
DET2_D3  (via drill 0.25)
  Top 0.254: v121.28,30.61 J404.A11
  Route2 0.254: v114.94,21.46 121.28,27.81 v121.28,30.61
  Bottom 0.254: J402.B15 v114.94,21.46
DETB0_RUN  (via drill 0.25)
  Top 0.254: v59.05,30.61 J204.A16
  Route2 0.254: v56.52,10.29 57.15,10.92 57.15,21.46 | 57.15,21.46 57.15,24.13 59.69,26.67 59.69,29.97 v59.05,30.61 | v56.52,21.46 57.15,21.46
  Bottom 0.254: J202.B7 v56.52,21.46 | J201.B7 v56.52,10.29
DETB1_RUN  (via drill 0.25)
  Top 0.254: v93.34,30.61 J304.A16 | J306.1 93.98,10.54 91.95,12.57 v90.81,12.57
  Route2 0.254: v90.81,12.57 91.44,13.21 91.44,21.46 | 91.44,21.46 91.44,24.26 93.98,26.8 93.98,29.97 v93.34,30.61 | v90.81,21.46 91.44,21.46
  Bottom 0.254: J302.B7 v90.81,21.46 | J301.B7 v90.81,12.57
DETB2_RUN  (via drill 0.25)
  Top 0.254: v127.64,30.61 J404.A16
  Route2 0.254: v125.09,10.29 125.73,10.92 125.73,21.46 | 125.73,21.46 125.73,24.38 128.27,26.92 128.27,29.97 v127.64,30.61 | v125.09,21.46 125.73,21.46
  Bottom 0.254: J401.B7 v125.09,10.29 | J402.B7 v125.09,21.46
GND  (via drill 0.25)
  Top 0.254: J304.A17 v94.61,30.61 | J304.B17 v94.61,27.56 | J304.A19 v97.16,30.61 | J304.A15 v92.08,30.61 | J304.A14 v90.81,30.61 | J304.A13 v89.53,30.61 | J304.A12 v88.27,30.61 | J304.B12 v88.27,27.56 | J304.A8 v83.19,30.61 | J304.B8 v83.19,27.56 | J304.A4 v78.11,30.61 | J304.B4 v78.11,27.56 | J304.B3 v76.83,27.56 | J304.A1 v74.3,30.61 | J404.A1 v108.58,30.61 | J404.A4 v112.39,30.61 | J404.B3 v111.12,27.56 | J404.B4 v112.39,27.56 | J404.B8 v117.47,27.56 | J404.A8 v117.47,30.61 | J404.A12 v122.56,30.61 | J404.A13 v123.83,30.61 | J404.A14 v125.09,30.61 | J404.A15 v126.36,30.61 | J404.B12 v122.56,27.56 | J404.A17 v128.91,30.61 | J404.B17 v128.91,27.56 | J404.A19 v131.44,30.61 | J204.B17 v60.33,27.56 | J204.A17 v60.33,30.61 | J204.A15 v57.78,30.61 | v56.52,30.61 J204.A14 | v55.24,30.61 J204.A13 | v53.98,30.61 J204.A12 | J204.A19 v62.87,30.61 | J204.A8 v48.9,30.61 | v48.9,27.56 J204.B8 | v53.98,27.56 J204.B12 | J204.B4 v43.81,27.56 | J204.B3 v42.55,27.56 | J204.A4 v43.81,30.61 | J204.A1 v40.01,30.61 | J305.4 81.28,6.35 v81.92,6.99 | J305.2 82.55,6.35 v83.19,6.99 | J305.6 80.01,6.35 v79.38,6.99 | J305.8 78.74,6.35 v78.11,6.99 | J306.8 90.17,6.35 v89.53,6.99 | J306.6 91.44,6.35 v90.81,6.99 | J306.4 92.71,6.35 v93.34,6.99 | J306.2 93.98,6.35 v94.61,6.99
  Bottom 0.254: J202.B4 v60.33,21.46 | J202.B2 v62.87,21.46 | J202.A2 v62.87,18.16 | J202.A4 v60.33,18.16 | J202.A5 v59.05,18.16 | J202.A6 v57.78,18.16 | J202.A7 v56.52,18.16 | J202.A8 v55.24,18.16 | J202.A9 v53.98,18.16 | J202.A10 v52.7,18.16 | J202.A11 v51.44,18.16 | J202.A12 v50.16,18.16 | J202.A13 v48.9,18.16 | J202.A14 v47.62,18.16 | J202.A15 v46.35,18.16 | J202.A16 v45.09,18.16 | J202.A17 v43.81,18.16 | J202.A20 v40.01,18.16 | v42.55,21.46 J202.B18 | v41.27,21.46 J202.B19 | J202.B8 v55.24,21.46 | v42.55,10.29 J201.B18 | v41.27,10.29 J201.B19 | J201.A20 v40.01,6.99 | J201.A17 v43.81,6.99 | J201.A16 v45.09,6.99 | J201.A15 v46.35,6.99 | J201.A14 v47.62,6.99 | J201.A13 v48.9,6.99 | J201.A12 v50.16,6.99 | J201.A11 v51.44,6.99 | J201.A10 v52.7,6.99 | J201.A9 v53.98,6.99 | J201.A8 v55.24,6.99 | J201.A7 v56.52,6.99 | J201.A6 v57.78,6.99 | J201.A5 v59.05,6.99 | J201.A4 v60.33,6.99 | J201.A2 v62.87,6.99 | J201.B2 v62.87,10.29 | J201.B4 v60.33,10.29 | J201.B8 v55.24,10.29 | v109.86,10.29 J401.B19 | v111.12,10.29 J401.B18 | J401.A20 v108.58,6.99 | J401.A17 v112.39,6.99 | J401.A16 v113.67,6.99 | J401.A15 v114.94,6.99 | J401.A14 v116.2,6.99 | J401.A13 v117.47,6.99 | J401.A12 v118.75,6.99 | J401.A11 v120.02,6.99 | J401.A10 v121.28,6.99 | J401.A9 v122.56,6.99 | J401.A8 v123.83,6.99 | J401.A7 v125.09,6.99 | J401.A6 v126.36,6.99 | J401.A5 v127.64,6.99 | J401.A4 v128.91,6.99 | J401.A2 v131.44,6.99 | J401.B2 v131.44,10.29 | J401.B4 v128.91,10.29 | v123.83,10.29 J401.B8 | J402.A17 v112.39,18.16 | J402.A16 v113.67,18.16 | J402.A15 v114.94,18.16 | J402.A14 v116.2,18.16 | J402.A13 v117.47,18.16 | J402.A12 v118.75,18.16 | J402.A11 v120.02,18.16 | J402.A10 v121.28,18.16 | J402.A9 v122.56,18.16 | J402.A8 v123.83,18.16 | J402.A7 v125.09,18.16
  Bottom 0.254: J402.A6 v126.36,18.16 | J402.A5 v127.64,18.16 | J402.A4 v128.91,18.16 | J402.A2 v131.44,18.16 | J402.B2 v131.44,21.46 | J402.B4 v128.91,21.46 | v123.83,21.46 J402.B8 | v75.56,10.29 J301.B19 | v76.83,10.29 J301.B18 | J302.A20 v74.3,18.16 | J302.B19 v75.56,21.46 | J302.B18 v76.83,21.46 | J301.A17 v78.11,6.99 | J301.A20 v74.3,6.99 | J301.A16 v79.38,6.99 | J301.A15 v80.64,6.99 | J301.A14 v81.92,6.99 | J301.A13 v83.19,6.99 | J301.A12 v84.45,6.99 | J301.A11 v85.72,6.99 | J301.A10 v87,6.99 | J301.A9 v88.27,6.99 | J301.A8 v89.53,6.99 | J301.A7 v90.81,6.99 | J301.A6 v92.08,6.99 | J301.A5 v93.34,6.99 | J301.A4 v94.61,6.99 | J301.A2 v97.16,6.99 | J301.B4 v94.61,10.29 | J301.B2 v97.16,10.29 | J302.A8 v89.53,18.16 | J302.A9 v88.27,18.16 | J302.A6 v92.08,18.16 | J302.A5 v93.34,18.16 | J302.A4 v94.61,18.16 | J302.A2 v97.16,18.16 | J301.B8 v89.53,12.57 | J302.A17 v78.11,18.16 | J302.A16 v79.38,18.16 | J302.A15 v80.64,18.16 | J302.A13 v83.19,18.16 | J302.A14 v81.92,18.16 | J302.A12 v84.45,18.16 | J302.A11 v85.72,18.16 | J302.A10 v87,18.16 | J302.A7 v90.81,18.16 | J302.B2 v97.16,21.46 | J302.B4 v94.61,21.46 | J302.B8 v89.53,21.46 | J402.A20 v108.58,18.16 | J402.B19 v109.86,21.46 | J402.B18 v111.12,21.46
  pour Route15 (isolate 0.203, rank 3): 35.56,35.31 36.32,36.07 138.43,36.07 138.43,0 36.32,0 35.56,0.76
  pour Route2 (isolate 0.203, rank 4): 35.56,35.31 36.32,36.07 138.43,36.07 138.43,0 36.32,0 35.56,0.76
GND_SRC  (via drill 0.25)
  Top 0.254: J104.A19 v28.57,30.61 | J104.A17 v26.04,30.61 | J104.A16 v24.77,30.61 | J104.A15 v23.5,30.61 | J104.A14 v22.23,30.61 | J104.A13 v20.95,30.61 | J104.B17 v26.04,27.56 | J104.A12 v19.68,30.61 | J104.A9 v15.88,30.61 | J104.B3 v8.26,27.56 | J104.A1 v5.71,30.61 | J112.2 25.4,6.35 v26.04,6.99 | J112.4 24.13,6.35 v24.77,6.99 | J112.6 22.86,6.35 v22.23,6.99 | J112.8 21.59,6.35 v20.95,6.99 | J111.2 13.97,6.35 v14.61,6.99 | J111.4 12.7,6.35 v13.34,6.99 | J111.6 11.43,6.35 v10.79,6.99 | J111.8 10.16,6.35 v9.53,6.99
  Bottom 0.254: J102.B4 v26.04,21.46 | J102.B2 v28.57,21.46 | J102.A2 v28.57,18.16 | J102.A5 v24.77,18.16 | J102.A4 v26.04,18.16 | J102.A7 v22.23,18.16 | J102.A8 v20.95,18.16 | J102.B8 v20.95,21.46 | J102.A9 v19.68,18.16 | J102.A10 v18.41,18.16 | J102.A11 v17.14,18.16 | J102.A12 v15.88,18.16 | J102.A13 v14.61,18.16 | J102.A14 v13.34,18.16 | J102.A15 v12.06,18.16 | J102.A16 v10.79,18.16 | J102.A17 v9.53,18.16 | J102.A20 v5.71,18.16 | v6.99,21.46 J102.B19 | v8.26,21.46 J102.B18 | J102.A6 v23.5,18.16 | v8.26,10.29 J101.B18 | v6.99,10.29 J101.B19 | J101.A20 v5.71,6.99 | J101.A17 v9.53,6.99 | J101.A16 v10.79,6.99 | J101.A15 v12.06,6.99 | J101.A14 v13.34,6.99 | J101.A12 v15.88,6.99 | J101.A10 v18.41,6.99 | J101.A9 v19.68,6.99 | J101.A8 v20.95,6.99 | J101.A7 v22.23,6.99 | J101.A6 v23.5,6.99 | J101.A5 v24.77,6.99 | J101.A4 v26.04,6.99 | v28.57,10.29 J101.B2 | J101.B4 v26.04,10.29 | J101.A2 v28.57,6.99 | J101.B8 v20.95,12.57 | J101.A11 v17.14,6.99 | J101.A13 v14.61,6.99
  pour Route2 (isolate 0.203, rank 2): 0,36.07 33.53,36.07 34.29,35.31 34.29,0.76 33.53,0 0,0
  pour Route15 (isolate 0.203, rank 2): 0,36.07 33.53,36.07 34.29,35.31 34.29,0.76 33.53,0 0,0
N$2  (via drill 0.25)
  Top 0.254: TP201.P$1 v53.98,10.29
  Bottom 0.254: v53.98,10.29 J201.B9
RES0_1  (via drill 0.25)
  Top 0.254: TP202.P$1 v53.98,21.46
  Bottom 0.254: J202.B9 v53.98,21.46
RES1_0  (via drill 0.25)
  Top 0.254: v88.27,12.57 TP301.P$1 91.82,11.43 92.71,10.54 J306.3
  Bottom 0.254: v88.27,12.57 J301.B9
RES1_1  (via drill 0.25)
  Top 0.254: v88.27,21.46 TP302.P$1
  Bottom 0.254: J302.B9 v88.27,21.46
RES2_0  (via drill 0.25)
  Top 0.254: v122.56,10.29 TP401.P$1
  Bottom 0.254: J401.B9 v122.56,10.29
RES2_1  (via drill 0.25)
  Top 0.254: v122.56,21.46 TP402.P$1
  Bottom 0.254: J402.B9 v122.56,21.46
RES_S_0  (via drill 0.25)
  Top 0.254: v19.68,12.57 TP101.P$1 22.86,11.43 24.13,10.16 J112.3
  Bottom 0.254: v19.68,12.57 J101.B9
RES_S_1  (via drill 0.25)
  Top 0.254: TP102.P$1 v19.68,21.46
  Bottom 0.254: v19.68,21.46 J102.B9
SRCB_LED_EN  (via drill 0.25)
  Top 0.254: J104.B15 v23.5,25.27 | J112.7 18.86,8.57 v17.14,10.29
  Route2 0.254: v17.14,10.29 17.14,17.14 17.78,17.78 17.78,18.54 17.14,19.18 v17.14,21.46 18.41,22.73 20.95,22.73 v23.5,25.27
  Bottom 0.254: J102.B11 v17.14,21.46 | J101.B11 v17.14,10.29
SRCB_RUN  (via drill 0.25)
  Top 0.254: J104.B12 19.68,25.27 22.23,22.73 v22.23,21.46 | J112.1 25.4,9.91 22.73,12.57 v22.23,12.57
  Route2 0.254: v22.23,12.57 22.23,17.14 22.86,17.78 22.86,18.54 22.23,19.18 v22.23,21.46
  Bottom 0.254: J102.B7 v22.23,21.46 | J101.B7 v22.23,12.57
SRCB_SELECT00  (via drill 0.25)
  Top 0.254: J104.B11 18.41,26.16 17.78,25.53 17.78,13.46 v14.61,10.29 12.95,10.29 12.7,10.03 J111.3
  Bottom 0.254: v14.61,10.29 J101.B13
SRCB_SELECT01  (via drill 0.25)
  Top 0.254: J104.B9 15.88,22.73 v14.61,21.46
  Bottom 0.254: J102.B13 v14.61,21.46
SRCB_SPARE  (via drill 0.25)
  Top 0.254: J104.B16 v24.77,25.27 | J112.5 22.86,10.03 22.61,10.29 v18.41,10.29
  Route2 0.254: v18.41,10.29 18.41,17.14 19.05,17.78 19.05,18.54 18.41,19.18 v18.41,21.46 19.05,22.1 21.59,22.1 v24.77,25.27
  Bottom 0.254: J102.B10 v18.41,21.46 | J101.B10 v18.41,10.29
SRCB_STEP  (via drill 0.25)
  Top 0.254: J104.B14 v22.23,25.27 | J111.1 14.8,8.57 15.88,9.65 v15.88,10.29
  Route2 0.254: v15.88,10.29 15.88,17.14 16.51,17.78 16.51,18.54 15.88,19.18 v15.88,21.46 17.78,23.37 20.32,23.37 v22.23,25.27
  Bottom 0.254: J101.B12 v15.88,10.29 | J102.B12 v15.88,21.46
UART_FPGA_TO_SRCB  (via drill 0.25)
  Top 0.254: J104.B13 v20.95,25.27 | J111.5 11.43,10.03 13.34,11.94 v13.34,12.57
  Route2 0.254: v13.34,12.57 13.34,17.14 13.97,17.78 13.97,18.54 13.34,19.18 v13.34,21.46 15.88,24 19.68,24 v20.95,25.27
  Bottom 0.254: J101.B14 v13.34,12.57 | J102.B14 v13.34,21.46
UART_SRCB_TO_FPGA00  (via drill 0.25)
  Top 0.254: v17.14,27.56 J104.B10 | J111.7 10.16,10.03 12.06,11.94 v12.06,12.57
  Route2 0.254: v12.06,12.57 12.06,17.14 11.43,17.78 11.43,21.84 v17.14,27.56
  Bottom 0.254: J101.B15 v12.06,12.57
UART_SRCB_TO_FPGA01  (via drill 0.25)
  Top 0.254: v18.41,30.61 J104.A11
  Route2 0.254: v18.41,30.61 17.78,29.97 17.78,27.18 v12.06,21.46
  Bottom 0.254: v12.06,21.46 J102.B15
V5P1_DET0  (via drill 0.25)
  Top 0.305: J204.B18 61.59,27.18 61.85,26.92 62.87,26.92 J204.B19 | 61.59,30.86 J204.A18 | J204.A20 64.17,29.75 65.02,30.61 | J204.B20 64.14,26.92 | v64.14,6.99 63.25,7.87 61.59,7.87 | v64.14,10.29 63.25,9.4 61.59,9.4 | v64.14,18.16 63.25,19.05 61.59,19.05 | v64.14,21.46 63.25,20.57 61.59,20.57
  Top 0.406: 62.87,26.92 64.14,26.92 64.64,26.92 65.28,27.56 65.28,30.35 65.02,30.61 64.26,31.37 62.1,31.37 61.59,30.86
  Top 1.27: v61.59,6.99 61.59,7.87 61.59,9.4 v61.59,10.29 v61.59,18.16 61.59,19.05 61.59,20.57 v61.59,21.46 61.59,24.64 62.87,25.91 62.87,26.92
  Bottom 0.254: J202.B3 v61.59,21.46 | J202.B1 v64.14,21.46 | J202.A1 v64.14,18.16 | v61.59,18.16 J202.A3 | J201.A3 v61.59,6.99 | J201.A1 v64.14,6.99 | J201.B1 v64.14,10.29 | J201.B3 v61.59,10.29
V5P1_DET1  (via drill 0.25)
  Top 0.305: J304.B18 95.89,27.18 96.14,26.92 97.16,26.92 J304.B19 | 95.89,30.73 J304.A18 | J304.A20 98.42,29.84 99.19,30.61 | J304.B20 98.42,26.92 | v98.42,21.46 97.54,20.57 95.89,20.57 | v98.42,18.16 97.54,19.05 95.89,19.05 | v98.42,10.29 97.54,9.4 95.89,9.4 | v98.42,6.99 97.54,7.87 95.89,7.87
  Top 0.406: 97.16,26.92 98.42,26.92 98.81,26.92 99.57,27.69 99.57,30.23 99.19,30.61 98.42,31.37 96.52,31.37 95.89,30.73
  Top 1.27: v95.89,6.99 95.89,7.87 95.89,9.4 v95.89,10.29 v95.89,18.16 95.89,19.05 95.89,20.57 v95.89,21.46 95.89,24.26 97.16,25.53 97.16,26.92
  Bottom 0.254: v95.89,6.99 J301.A3 TP303.P$1 | J301.A1 v98.42,6.99 | J301.B1 v98.42,10.29 | J301.B3 v95.89,10.29 | J302.A3 v95.89,18.16 | J302.A1 v98.42,18.16 | J302.B3 v95.89,21.46 | J302.B1 v98.42,21.46
V5P1_DET2  (via drill 0.25)
  Top 0.305: J404.B18 130.18,27.18 130.43,26.92 131.44,26.92 J404.B19 | 130.18,30.73 J404.A18 | J404.A20 132.72,29.84 133.48,30.61 | J404.B20 132.72,26.92 | v132.72,10.29 131.83,9.4 130.18,9.4 | v132.72,6.99 131.83,7.87 130.18,7.87 | v132.72,21.46 131.83,20.57 130.18,20.57 | v132.72,18.16 131.83,19.05 130.18,19.05
  Top 0.406: 131.44,26.92 132.72,26.92 133.1,26.92 133.86,27.69 133.86,30.23 133.48,30.61 132.72,31.37 130.81,31.37 130.18,30.73
  Top 1.27: v130.18,6.99 130.18,7.87 130.18,9.4 v130.18,10.29 v130.18,18.16 130.18,19.05 130.18,20.57 v130.18,21.46 130.18,24.64 131.44,25.91 131.44,26.92
  Bottom 0.254: v130.18,6.99 J401.A3 TP403.P$1 | J401.B3 v130.18,10.29 | J401.B1 v132.72,10.29 | J401.A1 v132.72,6.99 | J402.A3 v130.18,18.16 | J402.A1 v132.72,18.16 | J402.B3 v130.18,21.46 | J402.B1 v132.72,21.46
V5P1_SRC  (via drill 0.25)
  Top 0.305: v29.84,21.46 28.96,20.57 27.3,20.57 | v29.84,18.16 28.96,19.05 27.3,19.05 | v29.84,10.29 28.96,9.4 27.3,9.4 | v29.84,6.99 28.96,7.87 27.3,7.87 | J104.A18 27.3,30.86 | v27.3,26.16 27.5,26.35 27.3,26.54 J104.B18 | J104.B19 28.57,26.92 | J104.B20 29.84,26.92 | J104.A20 29.84,31.24
  Top 0.406: 27.3,30.86 27.69,31.24 29.84,31.24 30.23,31.24 30.99,30.48 30.99,27.43 30.48,26.92 29.84,26.92 28.57,26.92 28.07,26.92 27.5,26.35
  Top 1.27: v27.3,26.16 v27.3,21.46 27.3,20.57 27.3,19.05 v27.3,18.16 v27.3,10.29 27.3,9.4 27.3,7.87 v27.3,6.99
  Route2 1.016: v27.3,26.16 v27.3,6.99
  Bottom 0.254: J102.B3 v27.3,21.46 | J102.B1 v29.84,21.46 | J102.A3 v27.3,18.16 | J102.A1 v29.84,18.16 | v27.3,6.99 J101.A3 TP103.P$1 | J101.B3 v27.3,10.29 | J101.B1 v29.84,10.29 | J101.A1 v29.84,6.99
V9P0_DET0  (via drill 0.25)
  Top 0.305: J204.A3 v42.55,30.61
  Route2 0.305: 41.91,7.62 v42.55,6.99 | v42.55,18.16 41.91,18.16
  Route2 0.406: v42.55,30.61 41.91,29.97 41.91,18.16 41.91,7.62
  Bottom 0.254: J202.A18 v42.55,18.16 | J201.A18 v42.55,6.99
V9P0_DET1  (via drill 0.25)
  Top 0.305: J304.A3 v76.83,30.61
  Route2 0.305: 76.2,7.62 v76.83,6.99 | v76.83,18.16 76.2,18.16
  Route2 0.406: v76.83,30.61 76.2,29.97 76.2,18.16 76.2,7.62
  Bottom 0.254: J302.A18 v76.83,18.16 | v76.83,6.99 J301.A18 76.83,4.83 77.47,4.19 TP304.P$1
V9P0_DET2  (via drill 0.25)
  Top 0.305: J404.A3 v111.12,30.61
  Route2 0.305: 110.49,7.62 v111.12,6.99 | v111.12,18.16 110.49,18.16
  Route2 0.406: v111.12,30.61 110.49,29.97 110.49,18.16 110.49,7.62
  Bottom 0.254: v111.12,6.99 J401.A18 111.12,4.83 111.76,4.19 TP404.P$1 | J402.A18 v111.12,18.16
V9P0_SRC  (via drill 0.25)
  Top 0.305: v8.26,30.61 J104.A3
  Route2 0.305: v8.26,18.16 7.62,18.16 | v8.26,6.99 7.62,6.99
  Route2 0.406: 7.62,6.99 7.62,18.16 7.62,29.97 v8.26,30.61
  Bottom 0.254: J102.A18 v8.26,18.16 | v8.26,6.99 J101.A18 8.26,4.83 8.89,4.19 TP104.P$1
VN3P4_DET0  (via drill 0.25)
  Top 0.305: J204.A2 v41.27,30.61
  Route2 0.305: 40.64,7.62 v41.27,6.99 | v41.27,18.16 40.64,18.16
  Route2 0.406: v41.27,30.61 40.64,29.97 40.64,18.16 40.64,7.62
  Bottom 0.254: J202.A19 v41.27,18.16 | J201.A19 v41.27,6.99
VN3P4_DET1  (via drill 0.25)
  Top 0.305: J304.A2 v75.56,30.61
  Route2 0.305: 74.93,7.62 v75.56,6.99 | v75.56,18.16 74.93,18.16
  Route2 0.406: v75.56,30.61 74.93,29.97 74.93,18.16 74.93,7.62
  Bottom 0.254: v75.56,6.99 J301.A19 TP305.P$1 | J302.A19 v75.56,18.16
VN3P4_DET2  (via drill 0.25)
  Top 0.305: J404.A2 v109.86,30.61
  Route2 0.305: v109.86,30.61 109.22,29.97 | 109.22,7.62 v109.86,6.99 | v109.86,18.16 109.22,18.16
  Route2 0.406: 109.22,29.97 109.22,18.16 109.22,7.62
  Bottom 0.254: v109.86,6.99 J401.A19 TP405.P$1 | J402.A19 v109.86,18.16
VN3P4_SRC  (via drill 0.25)
  Top 0.305: v6.99,30.61 J104.A2
  Route2 0.305: v6.99,18.16 6.35,18.16 | v6.99,6.99 6.35,6.99
  Route2 0.406: 6.35,6.99 6.35,18.16 6.35,29.97 v6.99,30.61
  Bottom 0.254: J102.A19 v6.99,18.16 | v6.99,6.99 J101.A19 TP105.P$1
VN22_DET0  (via drill 0.25)
  Top 0.305: J204.B1 40.01,27.81 40.64,27.18 41.27,27.81 J204.B2 | 40.64,10.92 v40.01,10.29 | v40.01,21.46 40.51,21.46 40.64,21.34
  Top 0.406: 40.64,27.18 40.64,21.34 40.64,10.92
  Bottom 0.254: v40.01,21.46 J202.B20 | v40.01,10.29 J201.B20
VN22_DET1  (via drill 0.25)
  Top 0.305: J304.B1 74.3,27.81 74.93,27.18 75.56,27.81 J304.B2 | 74.93,10.92 v74.3,10.29 | v74.3,21.46 74.93,21.46
  Top 0.406: 74.93,27.18 74.93,21.46 74.93,10.92
  Bottom 0.254: J301.B20 v74.3,10.29 74.3,8.13 73.15,6.99 73.15,4.7 TP306.P$1 | J302.B20 v74.3,21.46
VN22_DET2  (via drill 0.25)
  Top 0.254: v108.58,21.46 109.22,21.46
  Top 0.305: J404.B1 108.58,27.81 109.22,27.18 109.86,27.81 J404.B2 | 109.22,10.92 v108.58,10.29
  Top 0.406: 109.22,27.18 109.22,21.46 109.22,10.92
  Bottom 0.254: J401.B20 v108.58,10.29 108.58,8 107.7,7.11 107.7,4.83 TP406.P$1 | J402.B20 v108.58,21.46
VN22_SRC  (via drill 0.25)
  Top 0.305: v5.71,10.29 6.35,10.29 | v5.71,21.46 6.35,21.46 | J104.B1 5.71,27.81 6.35,27.18 6.99,27.81 J104.B2
  Top 0.406: 6.35,10.29 6.35,21.46 6.35,27.18
  Bottom 0.254: J102.B20 v5.71,21.46 | J101.B20 v5.71,10.29 5.71,8 4.83,7.11 4.83,4.83 TP106.P$1

### Text on the board
Top: BZ
tPlace: Source / Backplane | Detector / Backplane B0 | Detector / Backplane B1 | Detector / Backplane B2 | GND | GND / SRC | NinjaNIRS 2026 / Combined Short 2Layer Backplane / (VCCS compatible) / v02 3/2026 | BU Neurophotonics
bPlace: Source / Backplane | Detector / Backplane B0 | Detector / Backplane B1 | Detector / Backplane B2 | S1 | D1 | D7 | D13 | S0 | D0 | D6 | D12 | -22V | -3.4V | 9.0V | GND / SRC | 5.1V | -22V | -3.4V | 9.0V | 5.1V | -22V | -3.4V | 9.0V | GND | 5.1V